# EAGLE design AD8402_WeinBridge_DCO (EAGLE 7.2.0)
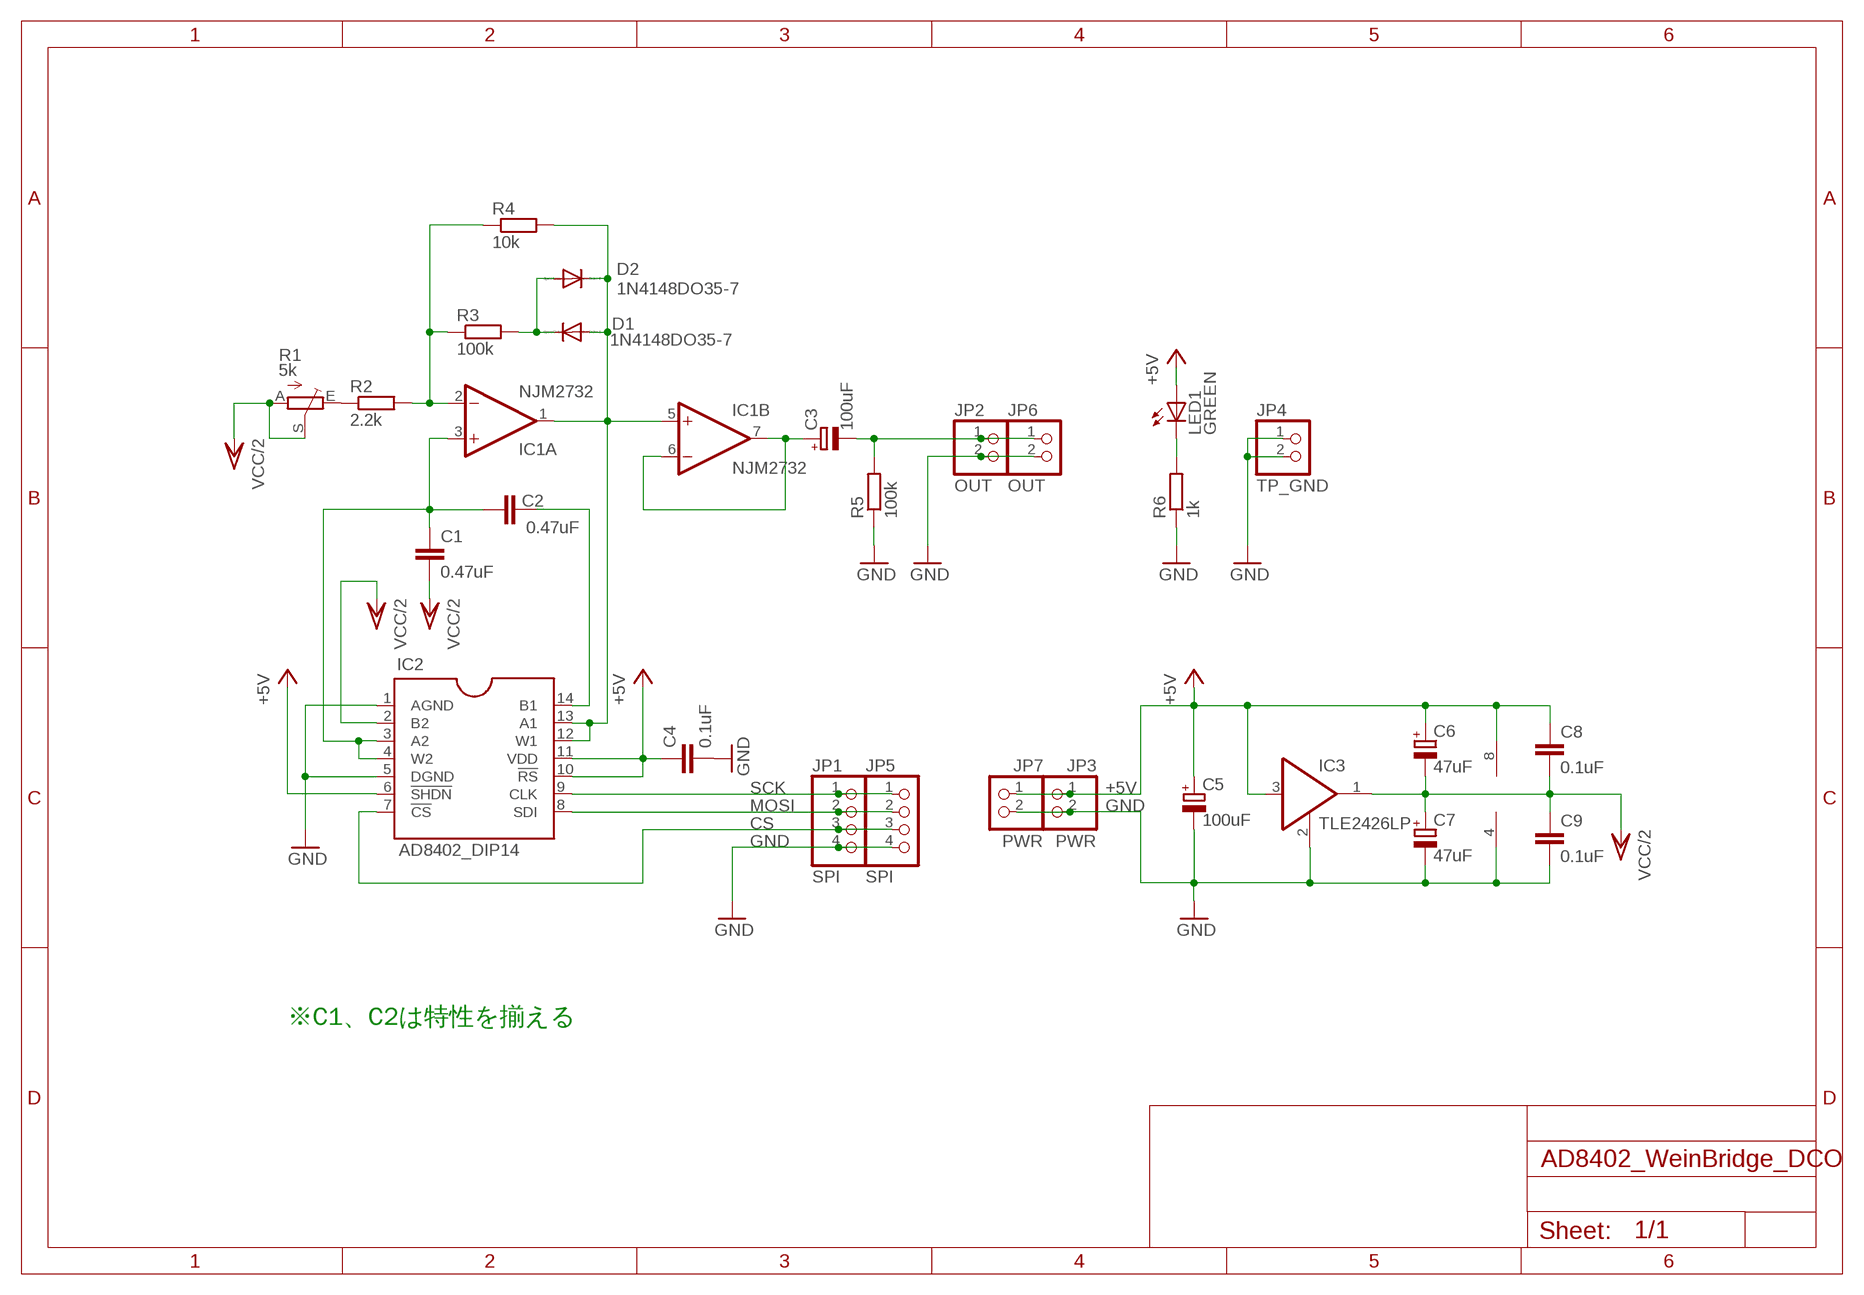
[diagram p0: schematic, sheet 1]

## Parts
C1  0.47uF  C-EU050-035X075  [C050-035X075]
C2  0.47uF  C-EU050-035X075  [C050-035X075]
C3  100uF  CPOL-EUE2.5-7  [E2,5-7]
C4  0.1uF  C-EU025-024X044  [C025-024X044]
C5  100uF  CPOL-EUSANYO_C6  [SANYO-OSCON_C6]
C6  47uF  CPOL-EUE2.5-6  [E2,5-6]
C7  47uF  CPOL-EUE2.5-6  [E2,5-6]
C8  0.1uF  C-EU025-024X044  [C025-024X044]
C9  0.1uF  C-EU025-024X044  [C025-024X044]
D1  1N4148DO35-7  [DO35-7]
D2  1N4148DO35-7  [DO35-7]
IC1  NJM2732  LM4558N  [DIL08]
IC2  AD8402_DIP14  [AD8402_DIP14]
IC3  TLE2426LP  [TO226AA]
JP1  SPI  PINHD-1X4  [1X04]
JP2  OUT  PINHD-1X2  [1X02]
JP3  PWR  PINHD-1X2  [1X02]
JP4  TP_GND  PINHD-1X2  [1X02]
JP5  SPI  PINHD-1X4  [1X04]
JP6  OUT  PINHD-1X2  [1X02]
JP7  PWR  PINHD-1X2  [1X02]
LED1  GREEN  LED3MM  [LED3MM]
R1  5k  TRIM_EU-B25P  [B25P]
R2  2.2k  R-EU_0207/7  [0207/7]
R3  100k  R-EU_0207/7  [0207/7]
R4  10k  R-EU_0207/7  [0207/7]
R5  100k  R-EU_0207/7  [0207/7]
R6  1k  R-EU_0207/7  [0207/7]

## Nets
+5V: C4.1 C5.+ C6.+ C8.1 IC1.8(P:V+) IC2.6(!SHDN) IC2.10(!RS) IC2.11(VDD) IC3.3(I) JP3.1 JP7.1 LED1.A
CS: IC2.7(!CS) JP1.3 JP5.3
GND: C4.2 C5.- C7.- C9.2 IC1.4(P:V-) IC2.1(AGND) IC2.5(DGND) IC3.2 JP1.4 JP2.2 JP3.2 JP4.1 JP4.2 JP5.4 JP6.2 JP7.2 R5.1 R6.1
MOSI: IC2.8(SDI) JP1.2 JP5.2
N$1: IC1.2(A:-IN) R2.2 R3.1 R4.1
N$2: R1.E R2.1
N$3: LED1.K(C) R6.2
N$4: C3.- JP2.1 JP6.1 R5.2
N$5: D1.C D2.A R3.2
N$6: D1.A D2.C IC1.1(A:OUT) IC1.5(B:+IN) IC2.12(W1) IC2.13(A1) R4.2
N$10: C1.1 C2.1 IC1.3(A:+IN) IC2.3(A2) IC2.4(W2)
N$11: C2.2 IC2.14(B1)
N$12: C3.+ IC1.6(B:-IN) IC1.7(B:OUT)
SCK: IC2.9(CLK) JP1.1 JP5.1
VCC/2: C1.2 C6.- C7.+ C8.2 C9.1 IC2.2(B2) IC3.1(O) R1.A R1.S

## Notes on the sheet
- ※C1、C2は特性を揃える

## Library data of the parts
C1 C2 C4 C8 C9 = rcl:C-EU: CAPACITOR, European symbol
C3 C5-C7 = rcl:CPOL-EU: POLARIZED CAPACITOR, European symbol
D1 D2 = diode:1N4148: DIODE high speed (Philips)
IC1 = linear:*4558: OP AMP
IC2 = mylib2:AD8402_DIP14: AD8402 DIP14 Analog Devices 2ch Digital Pot DIP化
IC3 = mylib2:TLE2426LP: TLE2426 Rail Spliter TO-92
JP1 JP5 = pinhead:PINHD-1X4: PIN HEADER
JP2-JP4 JP6 JP7 = pinhead:PINHD-1X2: PIN HEADER
LED1 = led:LED: LED OSRAM: - CHIPLED LG R971, LG N971, LY N971, LG Q971, LY Q971, LO R971, LY R971 LH N974, LH R974 LS Q976, LO Q976, LY Q976 LO Q996 - Hyper CHIPLED LW Q18S LB Q993, LB Q99A, LB R99A - SideLED LS A670, LO A670, LY A670, LG A670, LP A670 LB A673, LV A673, LT A673, LW A673 LH A674 LY A675 LS A676, LA A676, LO A676, LY A676, LW A676 LS A679, LY A679, LG A679 - Hyper Micro SIDELED® LS Y876, LA Y876, LO Y876, LY Y876 LT Y87S - SmartLED LW L88C, LW L88S LB L89C, LB L89S, LG L890 LS L89K, LO L89K, LY L89K LS L896, LA L896, LO L896, LY L896 - TOPLED LS T670, LO T670, LY T670, LG T670, LP T670 LSG T670, LSP T670, LSY T670, LOP T670, LYG T670 LG T671, LOG T671, LSG T671 LB T673, LV T673, LT T673, LW T673 LH T674 LS T676, LA T676, LO T676, LY T676, LB T676, LH T676, LSB T676, LW T676 LB T67C, LV T67C, LT T67C, LS T67K, LO T67K, LY T67K, LW E67C LS E67B, LA E67B, LO E67B, LY E67B, LB E67C, LV E67C, LT E67C LW T67C LS T679, LY T679, LG T679 LS T770, LO T770, LY T770, LG T770, LP T770 LB T773, LV T773, LT T773, LW T773 LH T774 LS E675, LA E675, LY E675, LS T675 LS T776, LA T776, LO T776, LY T776, LB T776 LHGB T686 LT T68C, LB T68C - Hyper Mini TOPLED® LB M676 - Mini TOPLED Santana® LG M470 LS M47K, LO M47K, LY M47K Source: http://www.osram.convergy.de LUXEON: - LUMILED® LXK2-PW12-R00, LXK2-PW12-S00, LXK2-PW14-U00, LXK2-PW14-V00 LXK2-PM12-R00, LXK2-PM12-S00, LXK2-PM14-U00 LXK2-PE12-Q00, LXK2-PE12-R00, LXK2-PE12-S00, LXK2-PE14-T00, LXK2-PE14-U00 LXK2-PB12-K00, LXK2-PB12-L00, LXK2-PB12-M00, LXK2-PB14-N00, LXK2-PB14-P00, LXK2-PB14-Q00 LXK2-PR12-L00, LXK2-PR12-M00, LXK2-PR14-Q00, LXK2-PR14-R00 LXK2-PD12-Q00, LXK2-PD12-R00, LXK2-PD12-S00 LXK2-PH12-R00, LXK2-PH12-S00 LXK2-PL12-P00, LXK2-PL12-Q00, LXK2-PL12-R00 Source: www.luxeon.com KINGBRIGHT: KA-3528ASYC Source: www.kingbright.com
R1 = pot:TRIM_EU-: POTENTIOMETER
R2-R6 = rcl:R-EU_: RESISTOR, European symbol

## Board
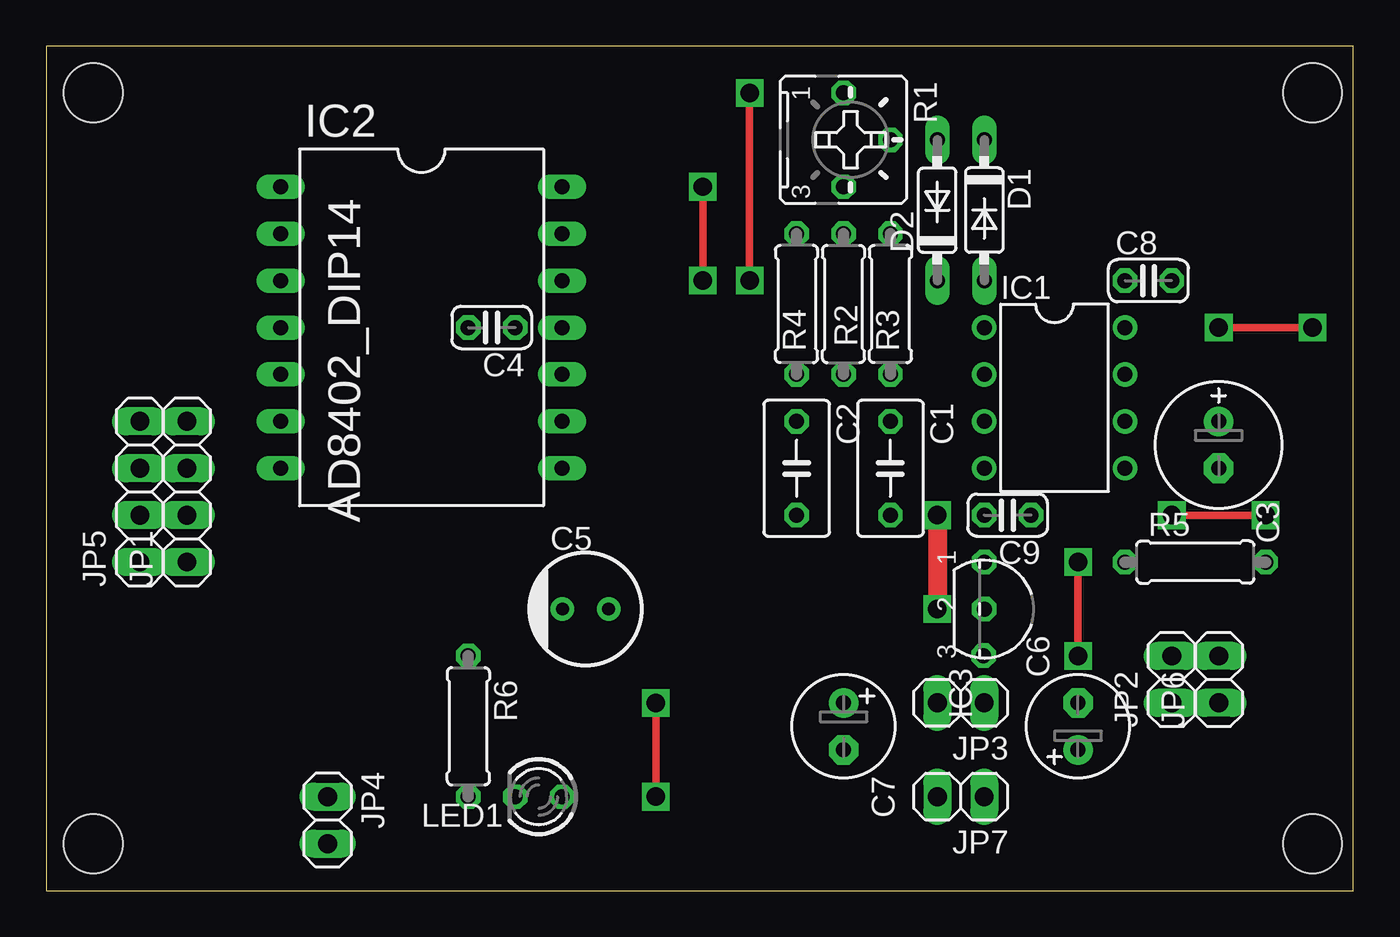
[diagram p1: board, top side]
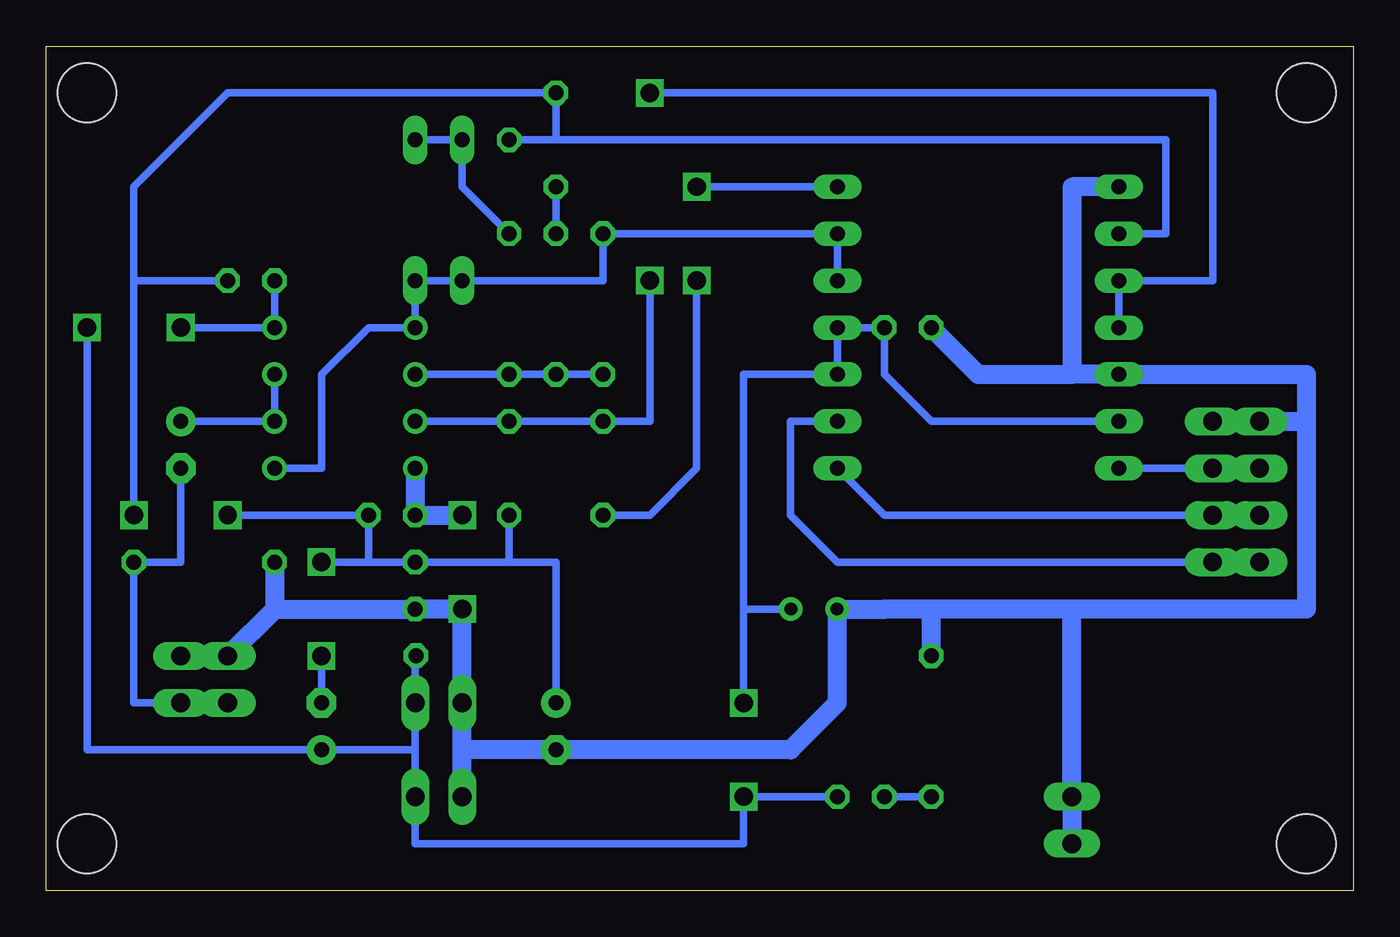
[diagram p2: board, bottom side, seen from below]

Size 70.79 x 45.71 mm. Coordinates in mm from the lower left corner, seen from the top.
Outline: 0,0 70.79,0 70.79,45.71 0,45.71 0,0
Copper layers (1*16): Top 0.035mm / dielectric 1.5mm / Bottom 0.035mm
Design rules "default": minimum track width 10mil, minimum drill 24mil, track to track 8mil, track to pad 8mil, pad to pad 8mil, via to via 8mil, smd to smd 8mil, copper to edge 40mil, drill to drill 8mil, minimum pad ring 10mil, minimum via ring 8mil, stop-mask expansion 4mil, vias tented up to drill 0mil, thermal gap 10mil
Holes 3.2 mm at 2.54,43.18 2.54,2.54 68.58,2.54 68.58,43.18

### Footprints (pad centres in the part's own frame; a part is rotated, then mirrored left to right if it is on the bottom)
C050-035X075 = drill 0.813 octagon: 1 -2.54,0; 2 2.54,0
E2,5-7 = drill 0.813 pad 1.6: + -1.27,0 | drill 0.813 pad 1.6 octagon: - 1.27,0
C025-024X044 = drill 0.813 octagon: 1 -1.27,0; 2 1.27,0
SANYO-OSCON_C6 = drill 0.7 pad 1.27: + 1.25,0; - -1.25,0
E2,5-6 = drill 0.813 pad 1.6: + -1.27,0 | drill 0.813 pad 1.6 octagon: - 1.27,0
DO35-7 = drill 0.813 long: A 3.81,0; C -3.81,0
DIL08 = drill 0.813 pad 1.27: 1 -3.81,-3.81; 2 -1.27,-3.81; 3 1.27,-3.81; 4 3.81,-3.81; 5 3.81,3.81; 6 1.27,3.81; 7 -1.27,3.81; 8 -3.81,3.81
AD8402_DIP14 = drill 0.813 long: 1 -8.89,-7.62; 2 -6.35,-7.62; 3 -3.81,-7.62; 4 -1.27,-7.62; 5 1.27,-7.62; 6 3.81,-7.62; 7 6.35,-7.62; 8 6.35,7.62; 9 3.81,7.62; 10 1.27,7.62; 11 -1.27,7.62; 12 -3.81,7.62; 13 -6.35,7.62; 14 -8.89,7.62
TO226AA = drill 0.813 octagon: 1 -2.544,0; 2 0.001,0; 3 2.524,-0.04
1X04 = drill 1.016 long: 1 -3.81,0; 2 -1.27,0; 3 1.27,0; 4 3.81,0
1X02 = drill 1.016 long: 1 -1.27,0; 2 1.27,0
LED3MM = drill 0.813 octagon: A -1.27,0; K 1.27,0
B25P = drill 0.813 octagon: A -2.54,0; E 2.54,0; S 0,2.54
0207/7 = drill 0.813 octagon: 1 -3.81,0; 2 3.81,0

### Placement (x,y rotation side)
C1  45.72,22.86 270 top
C2  40.64,22.86 270 top
C3  63.5,24.13 270 top
C4  24.13,30.48 180 top
C5  29.21,15.24 0 top
C6  55.88,8.89 90 top
C7  43.18,8.89 270 top
C8  59.69,33.02 0 top
C9  52.07,20.32 180 top
D1  50.8,36.83 270 top
D2  48.26,36.83 90 top
IC1  54.61,26.67 270 top
IC2  20.32,29.21 270 top
IC3  50.8,15.24 270 top
JP1  7.62,21.59 90 top
JP2  60.96,11.43 90 top
JP3  49.53,10.16 180 top
JP4  15.24,3.81 270 top
JP5  5.08,21.59 90 top
JP6  63.5,11.43 90 top
JP7  49.53,5.08 180 top
LED1  26.67,5.08 180 top
R1  43.18,40.64 270 top
R2  43.18,31.75 270 top
R3  45.72,31.75 90 top
R4  40.64,31.75 90 top
R5  62.23,17.78 0 top
R6  22.86,8.89 270 top

### Tracks (layer width: path | path; a pad name or v marks a point on that pad's centre or on a via)
+5V  (via drill 1)
  Top 0.406: v68.58,30.48 v63.5,30.48 | v33.02,10.16 v33.02,5.08
  Bottom 0.406: C8.1 IC1.8 v63.5,30.48 | 50.8,7.62 JP3.1 50.8,12.7 50.78,12.7 IC3.3 | 50.8,7.62 JP7.1 50.8,2.54 33.02,2.54 v33.02,5.08 LED1.A | v68.58,30.48 68.58,7.62 C6.+ 50.8,7.62 | v33.02,10.16 33.02,15.24 | 33.02,15.24 33.02,27.94 IC2.10 IC2.11 C4.1 25.4,27.94 22.86,25.4 IC2.6 | C5.+ 33.02,15.24
CS
  Bottom 0.406: IC2.7 JP1.3 JP5.3
GND  (via drill 1)
  Top 1.016: v48.26,20.32 v48.26,15.24
  Bottom 1.016: JP6.2 JP2.2 58.42,15.24 | v48.26,20.32 C9.2 IC1.4 | R5.1 58.42,15.24 | 58.42,15.24 IC3.2 v48.26,15.24 JP3.2 48.26,7.62 | JP7.2 48.26,7.62 | 48.26,7.62 C7.- 30.48,7.62 27.94,10.16 27.94,15.22 C5.- 25.42,15.22 25.4,15.24 22.86,15.24 | 15.24,27.94 IC2.5 2.54,27.94 2.54,25.4 | IC2.1 15.24,38.1 15.24,27.94 | 2.54,25.4 2.54,15.24 15.24,15.24 | 15.24,15.24 22.86,15.24 | 2.54,25.4 JP5.4 JP1.4 | R6.1 22.86,15.24 | 15.24,15.24 JP4.1 JP4.2 | C4.2 20.32,27.94 15.24,27.94
MOSI
  Bottom 0.406: IC2.8 25.4,20.32 JP1.2 JP5.2
N$1
  Bottom 0.406: IC1.2 R3.1 R2.2 R4.1
N$2
  Bottom 0.406: R1.E R2.1
N$3
  Bottom 0.406: R6.2 LED1.K
N$4
  Bottom 0.406: JP2.1 JP6.1 66.04,10.16 R5.2 63.5,17.78 C3.-
N$5
  Bottom 0.406: D1.C D2.A 48.26,38.1 R3.2
N$6
  Bottom 0.406: IC1.5 55.88,22.86 55.88,27.94 53.34,30.48 IC1.1 D1.A D2.C 40.64,33.02 R4.2 IC2.13 IC2.12
N$10  (via drill 1)
  Top 0.406: v38.1,43.18 v38.1,33.02
  Bottom 0.406: IC1.3 C1.1 C2.1 38.1,25.4 v38.1,33.02 | v38.1,43.18 7.62,43.18 7.62,33.02 IC2.3 IC2.4
N$11  (via drill 1)
  Top 0.406: v35.56,38.1 v35.56,33.02
  Bottom 0.406: IC2.14 v35.56,38.1 | C2.2 38.1,20.32 35.56,22.86 v35.56,33.02
N$12
  Bottom 0.406: IC1.7 IC1.6 C3.+
SCK
  Bottom 0.406: IC2.9 30.48,25.4 30.48,20.32 27.94,17.78 JP1.1 JP5.1
VCC/2  (via drill 1)
  Top 0.406: v66.04,20.32 v60.96,20.32 | v55.88,12.7 v55.88,17.78
  Bottom 0.406: v66.04,20.32 66.04,33.02 | 66.04,33.02 C8.2 | v60.96,20.32 C9.1 53.34,17.78 | 53.34,17.78 IC3.1 45.72,17.78 | 45.72,17.78 C1.2 | C6.- v55.88,12.7 | v55.88,17.78 53.34,17.78 | C7.+ 43.18,17.78 45.72,17.78 | 66.04,33.02 66.04,38.1 60.96,43.18 R1.A 43.18,40.64 | IC2.2 10.16,35.56 10.16,40.64 43.18,40.64 | 43.18,40.64 R1.S